# EasyEDA schematic LinePCB_Schematic_ETCautoPrikratki.json
TITLE: PCB linija; REV: 1.0; Date: 2022-11-15; Sheet: 1/1; Drawn By: Juraj Kolarić; Company: Udruga Robofreak
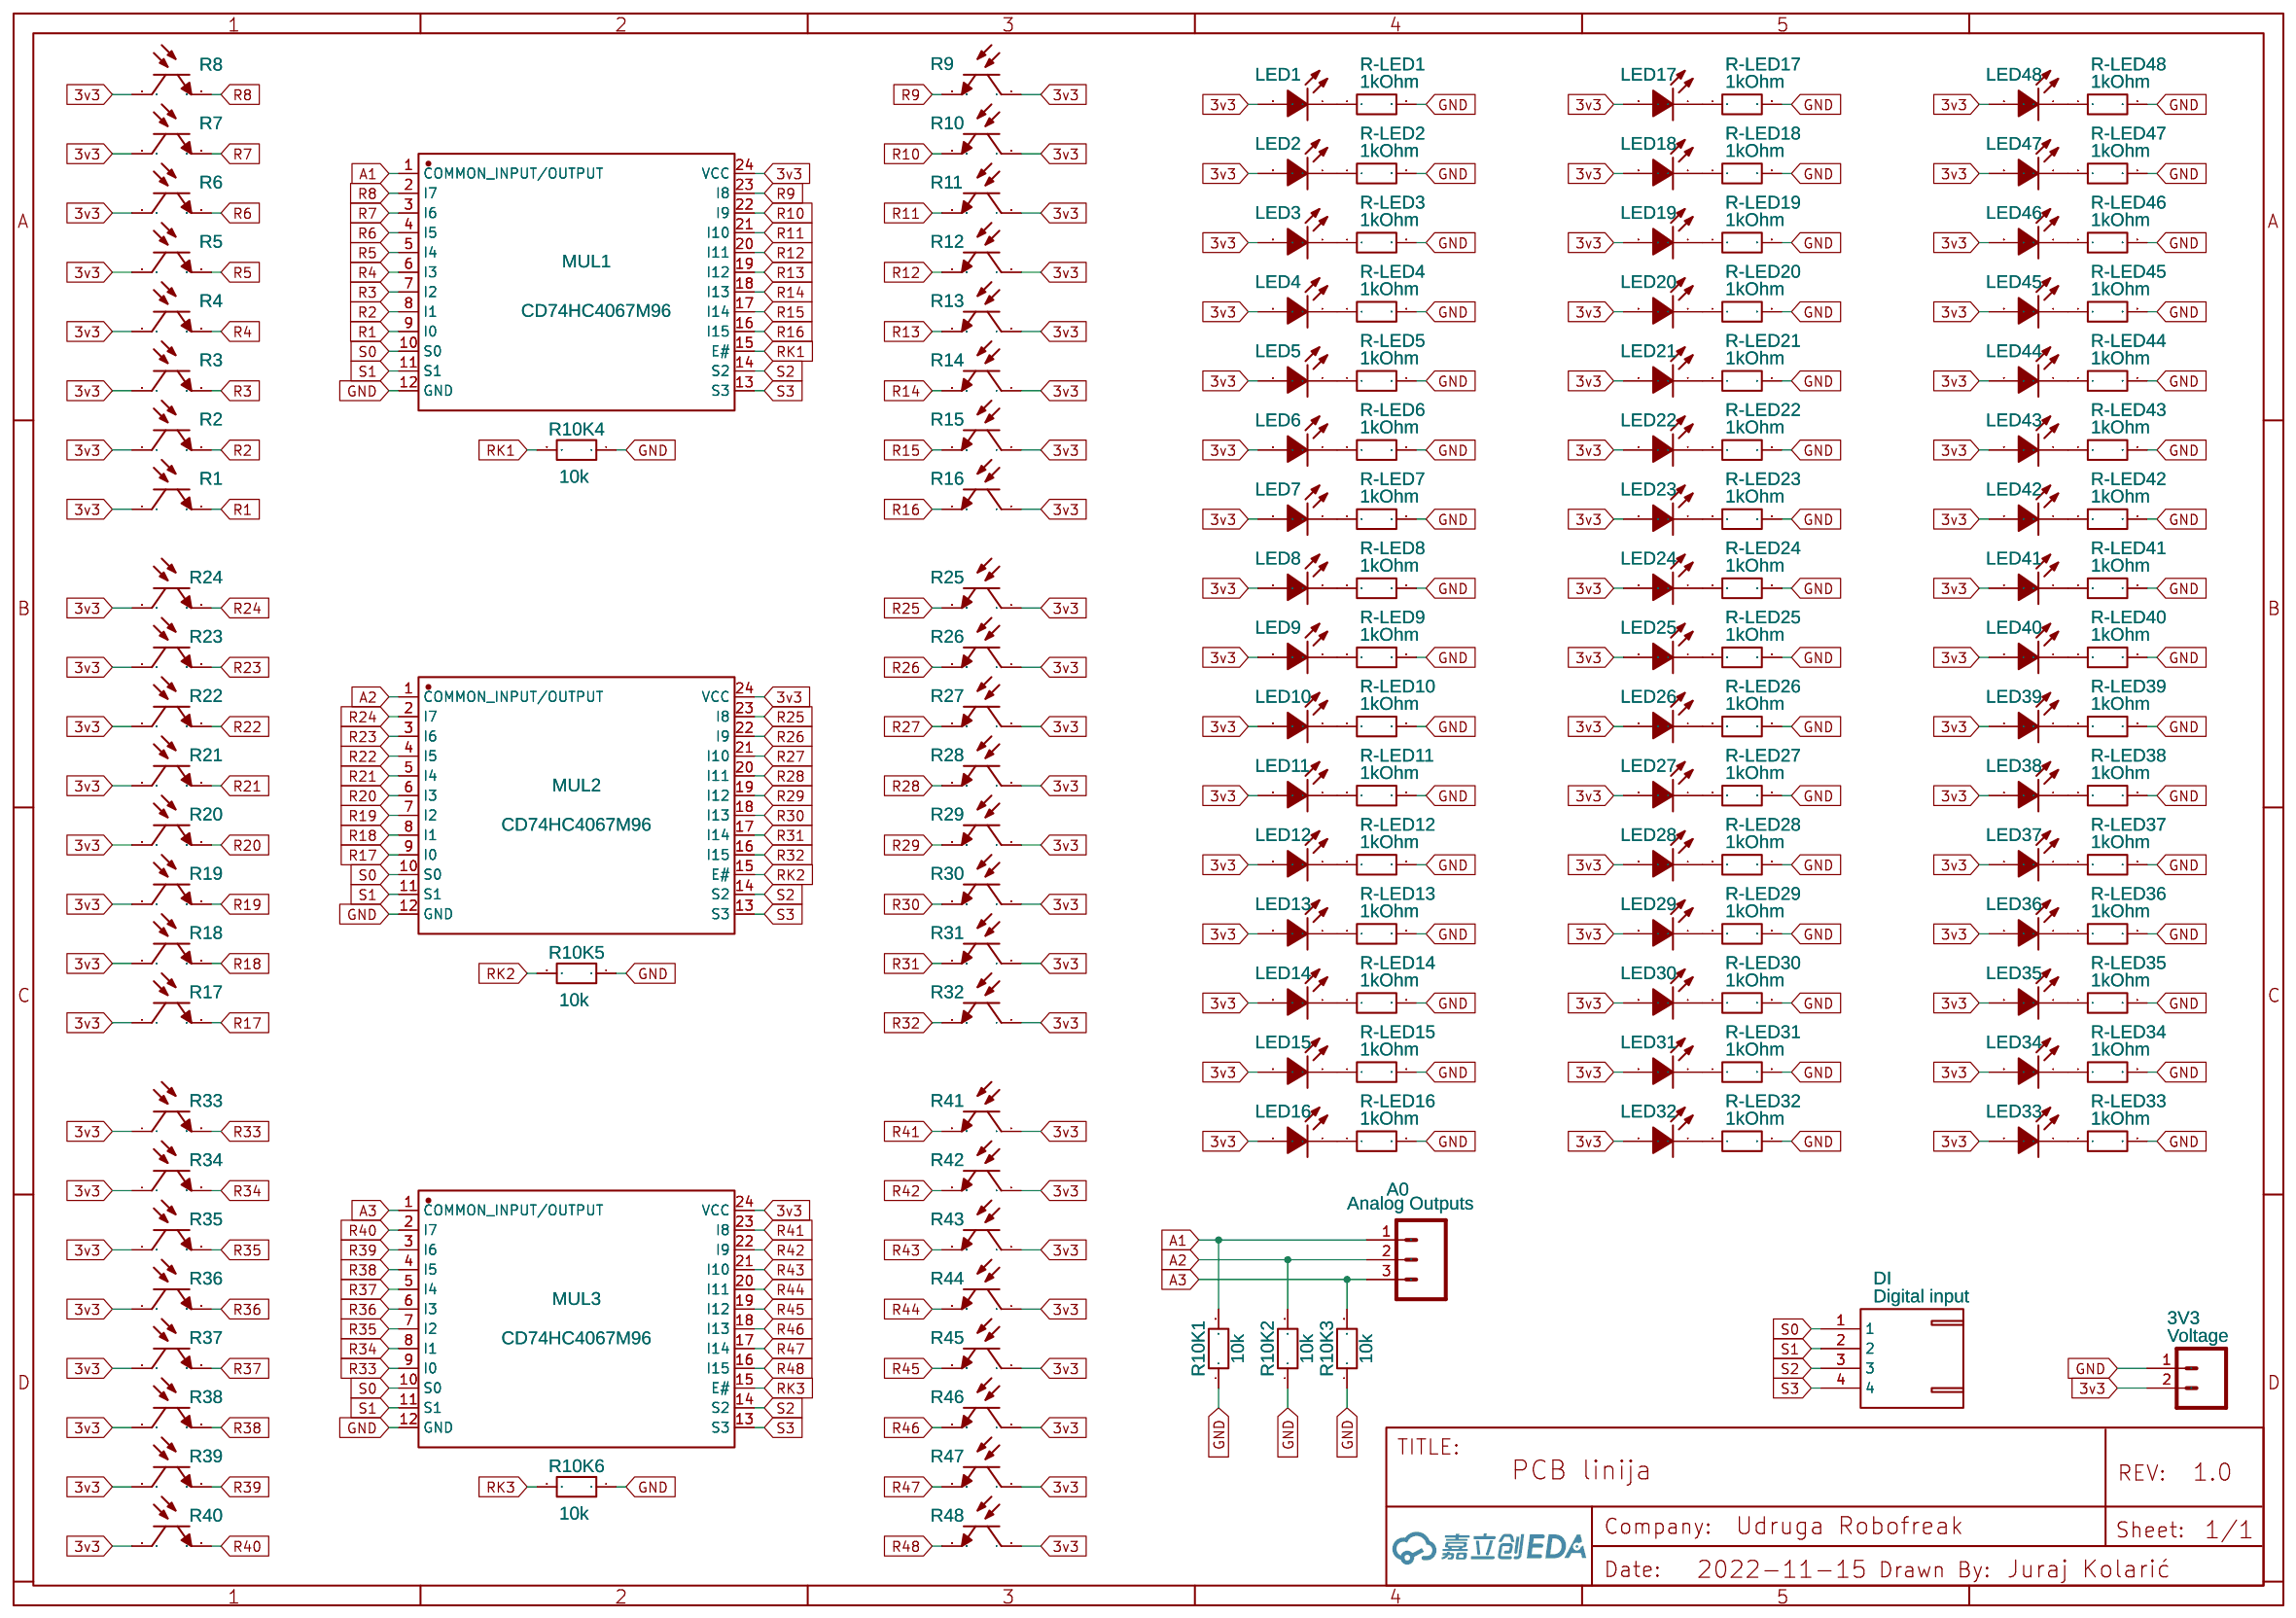
[diagram p0: schematic sheet]

## Parts
3V3  Voltage  [JST_XH_1X02_2.50MM_THM]
A0  Analog Outputs  [JST_XH_1X03_2.50MM_THM]
DI  Digital input  [JST-XH-4-PIN]
LED1  3528 Red LED  [LED-SMD_L3.5-W2.7-R-RD]
LED2  3528 Red LED  [LED-SMD_L3.5-W2.7-R-RD]
LED3  3528 Red LED  [LED-SMD_L3.5-W2.7-R-RD]
LED4  3528 Red LED  [LED-SMD_L3.5-W2.7-R-RD]
LED5  3528 Red LED  [LED-SMD_L3.5-W2.7-R-RD]
LED6  3528 Red LED  [LED-SMD_L3.5-W2.7-R-RD]
LED7  3528 Red LED  [LED-SMD_L3.5-W2.7-R-RD]
LED8  3528 Red LED  [LED-SMD_L3.5-W2.7-R-RD]
LED9  3528 Red LED  [LED-SMD_L3.5-W2.7-R-RD]
LED10  3528 Red LED  [LED-SMD_L3.5-W2.7-R-RD]
LED11  3528 Red LED  [LED-SMD_L3.5-W2.7-R-RD]
LED12  3528 Red LED  [LED-SMD_L3.5-W2.7-R-RD]
LED13  3528 Red LED  [LED-SMD_L3.5-W2.7-R-RD]
LED14  3528 Red LED  [LED-SMD_L3.5-W2.7-R-RD]
LED15  3528 Red LED  [LED-SMD_L3.5-W2.7-R-RD]
LED16  3528 Red LED  [LED-SMD_L3.5-W2.7-R-RD]
LED17  3528 Red LED  [LED-SMD_L3.5-W2.7-R-RD]
LED18  3528 Red LED  [LED-SMD_L3.5-W2.7-R-RD]
LED19  3528 Red LED  [LED-SMD_L3.5-W2.7-R-RD]
LED20  3528 Red LED  [LED-SMD_L3.5-W2.7-R-RD]
LED21  3528 Red LED  [LED-SMD_L3.5-W2.7-R-RD]
LED22  3528 Red LED  [LED-SMD_L3.5-W2.7-R-RD]
LED23  3528 Red LED  [LED-SMD_L3.5-W2.7-R-RD]
LED24  3528 Red LED  [LED-SMD_L3.5-W2.7-R-RD]
LED25  3528 Red LED  [LED-SMD_L3.5-W2.7-R-RD]
LED26  3528 Red LED  [LED-SMD_L3.5-W2.7-R-RD]
LED27  3528 Red LED  [LED-SMD_L3.5-W2.7-R-RD]
LED28  3528 Red LED  [LED-SMD_L3.5-W2.7-R-RD]
LED29  3528 Red LED  [LED-SMD_L3.5-W2.7-R-RD]
LED30  3528 Red LED  [LED-SMD_L3.5-W2.7-R-RD]
LED31  3528 Red LED  [LED-SMD_L3.5-W2.7-R-RD]
LED32  3528 Red LED  [LED-SMD_L3.5-W2.7-R-RD]
LED33  3528 Red LED  [LED-SMD_L3.5-W2.7-R-RD]
LED34  3528 Red LED  [LED-SMD_L3.5-W2.7-R-RD]
LED35  3528 Red LED  [LED-SMD_L3.5-W2.7-R-RD]
LED36  3528 Red LED  [LED-SMD_L3.5-W2.7-R-RD]
LED37  3528 Red LED  [LED-SMD_L3.5-W2.7-R-RD]
LED38  3528 Red LED  [LED-SMD_L3.5-W2.7-R-RD]
LED39  3528 Red LED  [LED-SMD_L3.5-W2.7-R-RD]
LED40  3528 Red LED  [LED-SMD_L3.5-W2.7-R-RD]
LED41  3528 Red LED  [LED-SMD_L3.5-W2.7-R-RD]
LED42  3528 Red LED  [LED-SMD_L3.5-W2.7-R-RD]
LED43  3528 Red LED  [LED-SMD_L3.5-W2.7-R-RD]
LED44  3528 Red LED  [LED-SMD_L3.5-W2.7-R-RD]
LED45  3528 Red LED  [LED-SMD_L3.5-W2.7-R-RD]
LED46  3528 Red LED  [LED-SMD_L3.5-W2.7-R-RD]
LED47  3528 Red LED  [LED-SMD_L3.5-W2.7-R-RD]
LED48  3528 Red LED  [LED-SMD_L3.5-W2.7-R-RD]
MUL1  CD74HC4067M96  [SOIC-24_L15.4-W7.5-P1.27-LS10.3-BL]
MUL2  CD74HC4067M96  [SOIC-24_L15.4-W7.5-P1.27-LS10.3-BL]
MUL3  CD74HC4067M96  [SOIC-24_L15.4-W7.5-P1.27-LS10.3-BL]
R1  ALS-PT19-315C/L177/TR8  [SENSORS-SMD_ALS-PT19]
R2  ALS-PT19-315C/L177/TR8  [SENSORS-SMD_ALS-PT19]
R3  ALS-PT19-315C/L177/TR8  [SENSORS-SMD_ALS-PT19]
R4  ALS-PT19-315C/L177/TR8  [SENSORS-SMD_ALS-PT19]
R5  ALS-PT19-315C/L177/TR8  [SENSORS-SMD_ALS-PT19]
R6  ALS-PT19-315C/L177/TR8  [SENSORS-SMD_ALS-PT19]
R7  ALS-PT19-315C/L177/TR8  [SENSORS-SMD_ALS-PT19]
R8  ALS-PT19-315C/L177/TR8  [SENSORS-SMD_ALS-PT19]
R9  ALS-PT19-315C/L177/TR8  [SENSORS-SMD_ALS-PT19]
R10  ALS-PT19-315C/L177/TR8  [SENSORS-SMD_ALS-PT19]
R10K1  10k  [R_AXIAL-0.3]
R10K2  10k  [R_AXIAL-0.3]
R10K3  10k  [R_AXIAL-0.3]
R10K4  10k  [R_AXIAL-0.3]
R10K5  10k  [R_AXIAL-0.3]
R10K6  10k  [R_AXIAL-0.3]
R11  ALS-PT19-315C/L177/TR8  [SENSORS-SMD_ALS-PT19]
R12  ALS-PT19-315C/L177/TR8  [SENSORS-SMD_ALS-PT19]
R13  ALS-PT19-315C/L177/TR8  [SENSORS-SMD_ALS-PT19]
R14  ALS-PT19-315C/L177/TR8  [SENSORS-SMD_ALS-PT19]
R15  ALS-PT19-315C/L177/TR8  [SENSORS-SMD_ALS-PT19]
R16  ALS-PT19-315C/L177/TR8  [SENSORS-SMD_ALS-PT19]
R17  ALS-PT19-315C/L177/TR8  [SENSORS-SMD_ALS-PT19]
R18  ALS-PT19-315C/L177/TR8  [SENSORS-SMD_ALS-PT19]
R19  ALS-PT19-315C/L177/TR8  [SENSORS-SMD_ALS-PT19]
R20  ALS-PT19-315C/L177/TR8  [SENSORS-SMD_ALS-PT19]
R21  ALS-PT19-315C/L177/TR8  [SENSORS-SMD_ALS-PT19]
R22  ALS-PT19-315C/L177/TR8  [SENSORS-SMD_ALS-PT19]
R23  ALS-PT19-315C/L177/TR8  [SENSORS-SMD_ALS-PT19]
R24  ALS-PT19-315C/L177/TR8  [SENSORS-SMD_ALS-PT19]
R25  ALS-PT19-315C/L177/TR8  [SENSORS-SMD_ALS-PT19]
R26  ALS-PT19-315C/L177/TR8  [SENSORS-SMD_ALS-PT19]
R27  ALS-PT19-315C/L177/TR8  [SENSORS-SMD_ALS-PT19]
R28  ALS-PT19-315C/L177/TR8  [SENSORS-SMD_ALS-PT19]
R29  ALS-PT19-315C/L177/TR8  [SENSORS-SMD_ALS-PT19]
R30  ALS-PT19-315C/L177/TR8  [SENSORS-SMD_ALS-PT19]
R31  ALS-PT19-315C/L177/TR8  [SENSORS-SMD_ALS-PT19]
R32  ALS-PT19-315C/L177/TR8  [SENSORS-SMD_ALS-PT19]
R33  ALS-PT19-315C/L177/TR8  [SENSORS-SMD_ALS-PT19]
R34  ALS-PT19-315C/L177/TR8  [SENSORS-SMD_ALS-PT19]
R35  ALS-PT19-315C/L177/TR8  [SENSORS-SMD_ALS-PT19]
R36  ALS-PT19-315C/L177/TR8  [SENSORS-SMD_ALS-PT19]
R37  ALS-PT19-315C/L177/TR8  [SENSORS-SMD_ALS-PT19]
R38  ALS-PT19-315C/L177/TR8  [SENSORS-SMD_ALS-PT19]
R39  ALS-PT19-315C/L177/TR8  [SENSORS-SMD_ALS-PT19]
R40  ALS-PT19-315C/L177/TR8  [SENSORS-SMD_ALS-PT19]
R41  ALS-PT19-315C/L177/TR8  [SENSORS-SMD_ALS-PT19]
R42  ALS-PT19-315C/L177/TR8  [SENSORS-SMD_ALS-PT19]
R43  ALS-PT19-315C/L177/TR8  [SENSORS-SMD_ALS-PT19]
R44  ALS-PT19-315C/L177/TR8  [SENSORS-SMD_ALS-PT19]
R45  ALS-PT19-315C/L177/TR8  [SENSORS-SMD_ALS-PT19]
R46  ALS-PT19-315C/L177/TR8  [SENSORS-SMD_ALS-PT19]
R47  ALS-PT19-315C/L177/TR8  [SENSORS-SMD_ALS-PT19]
R48  ALS-PT19-315C/L177/TR8  [SENSORS-SMD_ALS-PT19]
R-LED1  1kOhm  [R_AXIAL-0.3]
R-LED2  1kOhm  [R_AXIAL-0.3]
R-LED3  1kOhm  [R_AXIAL-0.3]
R-LED4  1kOhm  [R_AXIAL-0.3]
R-LED5  1kOhm  [R_AXIAL-0.3]
R-LED6  1kOhm  [R_AXIAL-0.3]
R-LED7  1kOhm  [R_AXIAL-0.3]
R-LED8  1kOhm  [R_AXIAL-0.3]
R-LED9  1kOhm  [R_AXIAL-0.3]
R-LED10  1kOhm  [R_AXIAL-0.3]
R-LED11  1kOhm  [R_AXIAL-0.3]
R-LED12  1kOhm  [R_AXIAL-0.3]
R-LED13  1kOhm  [R_AXIAL-0.3]
R-LED14  1kOhm  [R_AXIAL-0.3]
R-LED15  1kOhm  [R_AXIAL-0.3]
R-LED16  1kOhm  [R_AXIAL-0.3]
R-LED17  1kOhm  [R_AXIAL-0.3]
R-LED18  1kOhm  [R_AXIAL-0.3]
R-LED19  1kOhm  [R_AXIAL-0.3]
R-LED20  1kOhm  [R_AXIAL-0.3]
R-LED21  1kOhm  [R_AXIAL-0.3]
R-LED22  1kOhm  [R_AXIAL-0.3]
R-LED23  1kOhm  [R_AXIAL-0.3]
R-LED24  1kOhm  [R_AXIAL-0.3]
R-LED25  1kOhm  [R_AXIAL-0.3]
R-LED26  1kOhm  [R_AXIAL-0.3]
R-LED27  1kOhm  [R_AXIAL-0.3]
R-LED28  1kOhm  [R_AXIAL-0.3]
R-LED29  1kOhm  [R_AXIAL-0.3]
R-LED30  1kOhm  [R_AXIAL-0.3]
R-LED31  1kOhm  [R_AXIAL-0.3]
R-LED32  1kOhm  [R_AXIAL-0.3]
R-LED33  1kOhm  [R_AXIAL-0.3]
R-LED34  1kOhm  [R_AXIAL-0.3]
R-LED35  1kOhm  [R_AXIAL-0.3]
R-LED36  1kOhm  [R_AXIAL-0.3]
R-LED37  1kOhm  [R_AXIAL-0.3]
R-LED38  1kOhm  [R_AXIAL-0.3]
R-LED39  1kOhm  [R_AXIAL-0.3]
R-LED40  1kOhm  [R_AXIAL-0.3]
R-LED41  1kOhm  [R_AXIAL-0.3]
R-LED42  1kOhm  [R_AXIAL-0.3]
R-LED43  1kOhm  [R_AXIAL-0.3]
R-LED44  1kOhm  [R_AXIAL-0.3]
R-LED45  1kOhm  [R_AXIAL-0.3]
R-LED46  1kOhm  [R_AXIAL-0.3]
R-LED47  1kOhm  [R_AXIAL-0.3]
R-LED48  1kOhm  [R_AXIAL-0.3]

## Library data of the parts
3V3 = JST-XH-1X02-2.50MM-THM JS: sourceId: Y4gQNLJH3; Supplier Part: 455-2257-ND; Supplier: Digi-Key; Contributor: LucAce
A0 = JST-XH-1X03-2.50MM-THM JS: sourceId: Y4gQNLJH3; Supplier Part: 455-2248-ND; Supplier: Digi-Key
DI = JST-XH-4-Pin: Contributor: loyboy
LED1-LED48 = 3528 Red LED: Supplier: LCSC; Manufacturer: XINGLIGHT(成兴光); Manufacturer Part: XL-3528SURC; Supplier Part: C2843800; JLCPCB Part Class: Extended Part
MUL1-MUL3 = CD74HC4067M96: Supplier: LCSC; Supplier Part: C496123; Manufacturer: TI(德州仪器); Contributor: LCSC; JLCPCB Part Class: Extended Part
R1-R48 = ALS-PT19-315C/L177/TR8: Supplier: LCSC; Manufacturer: EVERLIGHT; Contributor: LCSC; Supplier Part: C146233; JLCPCB Part Class: Extended Part
R10K1-R10K6 R-LED1-R-LED48 = R_AXIAL-0.3_EU: Contributor: LCEDA_Lib

## Nets
3v3: 3V3.2 LED1.2(A) LED2.2(A) LED3.2(A) LED4.2(A) LED5.2(A) LED6.2(A) LED7.2(A) LED8.2(A) LED9.2(A) LED10.2(A) LED11.2(A) LED12.2(A) LED13.2(A) LED14.2(A) LED15.2(A) LED16.2(A) LED17.2(A) LED18.2(A) LED19.2(A) LED20.2(A) LED21.2(A) LED22.2(A) LED23.2(A) LED24.2(A) LED25.2(A) LED26.2(A) LED27.2(A) LED28.2(A) LED29.2(A) LED30.2(A) LED31.2(A) LED32.2(A) LED33.2(A) LED34.2(A) LED35.2(A) LED36.2(A) LED37.2(A) LED38.2(A) LED39.2(A) LED40.2(A) LED41.2(A) LED42.2(A) LED43.2(A) LED44.2(A) LED45.2(A) LED46.2(A) LED47.2(A) LED48.2(A) MUL1.24(VCC) MUL2.24(VCC) MUL3.24(VCC) R1.1 R2.1 R3.1 R4.1 R5.1 R6.1 R7.1 R8.1 R9.1 R10.1 R11.1 R12.1 R13.1 R14.1 R15.1 R16.1 R17.1 R18.1 R19.1 R20.1 R21.1 R22.1 R23.1 R24.1 R25.1 R26.1 R27.1 R28.1 R29.1 R30.1 R31.1 R32.1 R33.1 R34.1 R35.1 R36.1 R37.1 R38.1 R39.1 R40.1 R41.1 R42.1 R43.1 R44.1 R45.1 R46.1 R47.1 R48.1
GND: 3V3.1 MUL1.12(GND) MUL2.12(GND) MUL3.12(GND) R10K1.1 R10K2.1 R10K3.1 R10K4.1 R10K5.1 R10K6.1 R-LED1.2 R-LED2.2 R-LED3.2 R-LED4.2 R-LED5.2 R-LED6.2 R-LED7.2 R-LED8.2 R-LED9.2 R-LED10.2 R-LED11.2 R-LED12.2 R-LED13.2 R-LED14.2 R-LED15.2 R-LED16.2 R-LED17.2 R-LED18.2 R-LED19.2 R-LED20.2 R-LED21.2 R-LED22.2 R-LED23.2 R-LED24.2 R-LED25.2 R-LED26.2 R-LED27.2 R-LED28.2 R-LED29.2 R-LED30.2 R-LED31.2 R-LED32.2 R-LED33.2 R-LED34.2 R-LED35.2 R-LED36.2 R-LED37.2 R-LED38.2 R-LED39.2 R-LED40.2 R-LED41.2 R-LED42.2 R-LED43.2 R-LED44.2 R-LED45.2 R-LED46.2 R-LED47.2 R-LED48.2
A1: A0.1 MUL1.1(COMMON INPUT/OUTPUT) R10K1.2
A2: A0.2 MUL2.1(COMMON INPUT/OUTPUT) R10K2.2
A3: A0.3 MUL3.1(COMMON INPUT/OUTPUT) R10K3.2
R1: MUL1.9(I0) R1.2
R2: MUL1.8(I1) R2.2
R3: MUL1.7(I2) R3.2
R4: MUL1.6(I3) R4.2
R5: MUL1.5(I4) R5.2
R6: MUL1.4(I5) R6.2
R7: MUL1.3(I6) R7.2
R8: MUL1.2(I7) R8.2
R9: MUL1.23(I8) R9.2
R10: MUL1.22(I9) R10.2
R11: MUL1.21(I10) R11.2
R12: MUL1.20(I11) R12.2
R13: MUL1.19(I12) R13.2
R14: MUL1.18(I13) R14.2
R15: MUL1.17(I14) R15.2
R16: MUL1.16(I15) R16.2
R17: MUL2.9(I0) R17.2
R18: MUL2.8(I1) R18.2
R19: MUL2.7(I2) R19.2
R20: MUL2.6(I3) R20.2
R21: MUL2.5(I4) R21.2
R22: MUL2.4(I5) R22.2
R23: MUL2.3(I6) R23.2
R24: MUL2.2(I7) R24.2
R25: MUL2.23(I8) R25.2
R26: MUL2.22(I9) R26.2
R27: MUL2.21(I10) R27.2
R28: MUL2.20(I11) R28.2
R29: MUL2.19(I12) R29.2
R30: MUL2.18(I13) R30.2
R31: MUL2.17(I14) R31.2
R32: MUL2.16(I15) R32.2
R33: MUL3.9(I0) R33.2
R34: MUL3.8(I1) R34.2
R35: MUL3.7(I2) R35.2
R36: MUL3.6(I3) R36.2
R37: MUL3.5(I4) R37.2
R38: MUL3.4(I5) R38.2
R39: MUL3.3(I6) R39.2
R40: MUL3.2(I7) R40.2
R41: MUL3.23(I8) R41.2
R42: MUL3.22(I9) R42.2
R43: MUL3.21(I10) R43.2
R44: MUL3.20(I11) R44.2
R45: MUL3.19(I12) R45.2
R46: MUL3.18(I13) R46.2
R47: MUL3.17(I14) R47.2
R48: MUL3.16(I15) R48.2
RK1: MUL1.15(E#) R10K4.2
RK2: MUL2.15(E#) R10K5.2
RK3: MUL3.15(E#) R10K6.2
S0: DI.1 MUL1.10(S0) MUL2.10(S0) MUL3.10(S0)
S1: DI.2 MUL1.11(S1) MUL2.11(S1) MUL3.11(S1)
S2: DI.3 MUL1.14(S2) MUL2.14(S2) MUL3.14(S2)
S3: DI.4 MUL1.13(S3) MUL2.13(S3) MUL3.13(S3)
Net-(LED1-1): LED1.1(K) R-LED1.1
Net-(LED2-1): LED2.1(K) R-LED2.1
Net-(LED3-1): LED3.1(K) R-LED3.1
Net-(LED4-1): LED4.1(K) R-LED4.1
Net-(LED5-1): LED5.1(K) R-LED5.1
Net-(LED6-1): LED6.1(K) R-LED6.1
Net-(LED7-1): LED7.1(K) R-LED7.1
Net-(LED8-1): LED8.1(K) R-LED8.1
Net-(LED9-1): LED9.1(K) R-LED9.1
Net-(LED10-1): LED10.1(K) R-LED10.1
Net-(LED11-1): LED11.1(K) R-LED11.1
Net-(LED12-1): LED12.1(K) R-LED12.1
Net-(LED13-1): LED13.1(K) R-LED13.1
Net-(LED14-1): LED14.1(K) R-LED14.1
Net-(LED15-1): LED15.1(K) R-LED15.1
Net-(LED16-1): LED16.1(K) R-LED16.1
Net-(LED17-1): LED17.1(K) R-LED17.1
Net-(LED18-1): LED18.1(K) R-LED18.1
Net-(LED19-1): LED19.1(K) R-LED19.1
Net-(LED20-1): LED20.1(K) R-LED20.1
Net-(LED21-1): LED21.1(K) R-LED21.1
Net-(LED22-1): LED22.1(K) R-LED22.1
Net-(LED23-1): LED23.1(K) R-LED23.1
Net-(LED24-1): LED24.1(K) R-LED24.1
Net-(LED25-1): LED25.1(K) R-LED25.1
Net-(LED26-1): LED26.1(K) R-LED26.1
Net-(LED27-1): LED27.1(K) R-LED27.1
Net-(LED28-1): LED28.1(K) R-LED28.1
Net-(LED29-1): LED29.1(K) R-LED29.1
Net-(LED30-1): LED30.1(K) R-LED30.1
Net-(LED31-1): LED31.1(K) R-LED31.1
Net-(LED32-1): LED32.1(K) R-LED32.1
Net-(LED33-1): LED33.1(K) R-LED33.1
Net-(LED34-1): LED34.1(K) R-LED34.1
Net-(LED35-1): LED35.1(K) R-LED35.1
Net-(LED36-1): LED36.1(K) R-LED36.1
Net-(LED37-1): LED37.1(K) R-LED37.1
Net-(LED38-1): LED38.1(K) R-LED38.1
Net-(LED39-1): LED39.1(K) R-LED39.1
Net-(LED40-1): LED40.1(K) R-LED40.1
Net-(LED41-1): LED41.1(K) R-LED41.1
Net-(LED42-1): LED42.1(K) R-LED42.1
Net-(LED43-1): LED43.1(K) R-LED43.1
Net-(LED44-1): LED44.1(K) R-LED44.1
Net-(LED45-1): LED45.1(K) R-LED45.1
Net-(LED46-1): LED46.1(K) R-LED46.1
Net-(LED47-1): LED47.1(K) R-LED47.1
Net-(LED48-1): LED48.1(K) R-LED48.1
